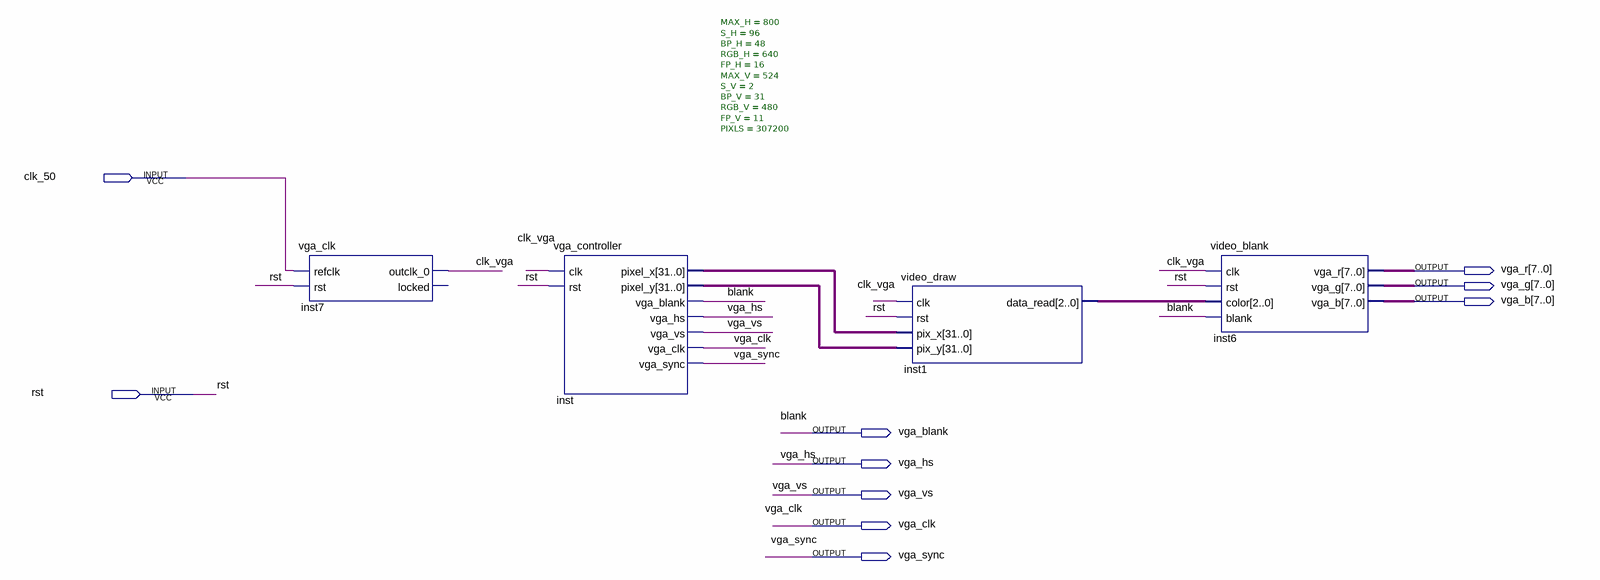
[diagram p0: schematic sheet]
// Quartus schematic lab3_top.bdf as structural Verilog: 4 symbols, 10 pins
module lab3_top (
  input  clk_50,
  input  rst,
  output [7:0] vga_r,
  output [7:0] vga_g,
  output [7:0] vga_b,
  output vga_blank,
  output vga_hs,
  output vga_vs,
  output vga_clk,
  output vga_sync
);

  wire clk_vga;
  wire [2:0] inst1_data_read;
  wire [31:0] inst_pixel_x, inst_pixel_y;

  vga_clk inst7 (.refclk(clk_50), .rst(rst), .outclk_0(clk_vga));  // open: locked
  vga_controller #(.MAX_H(800), .S_H(96), .BP_H(48), .RGB_H(640), .FP_H(16), .MAX_V(524), .S_V(2), .BP_V(31), .RGB_V(480), .FP_V(11), .PIXLS(307200)) inst (
    .clk(clk_vga), .rst(rst), .pixel_x(inst_pixel_x), .pixel_y(inst_pixel_y), .vga_blank(vga_blank),
    .vga_hs(vga_hs), .vga_vs(vga_vs), .vga_clk(vga_clk), .vga_sync(vga_sync));
  video_draw inst1 (.clk(clk_vga), .rst(rst), .pix_x(inst_pixel_x), .pix_y(inst_pixel_y), .data_read(inst1_data_read));
  video_blank inst6 (
    .clk(clk_vga), .rst(rst), .color(inst1_data_read), .blank(vga_blank), .vga_r(vga_r), .vga_g(vga_g),
    .vga_b(vga_b));

  // Other names for the same wires on the sheet: blank = vga_blank
endmodule
